# EAGLE design pcswtich (EAGLE 9.4.2)
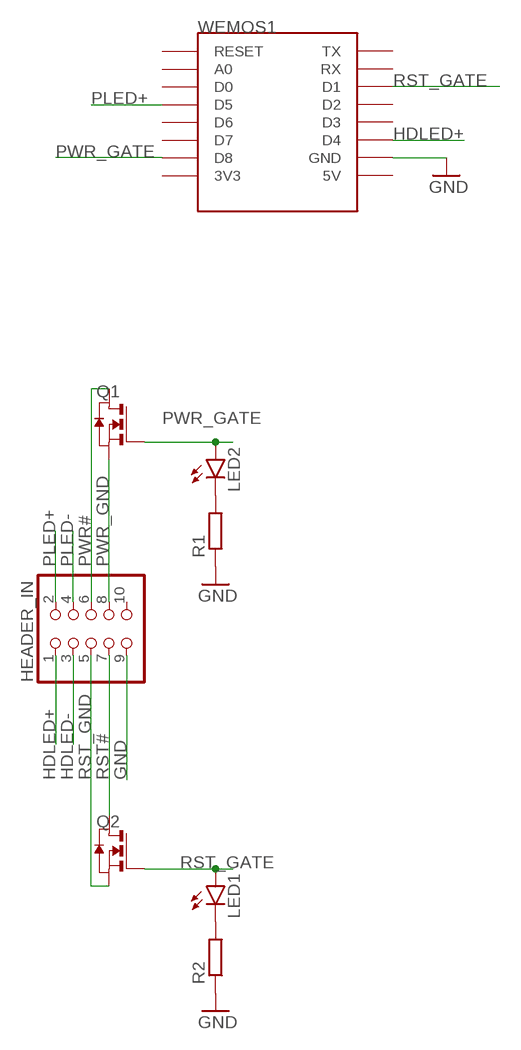
[diagram p0: schematic, sheet 1]

## Parts
HEADER_IN  PINHD-2X5  [2X05]
LED1  LEDCHIPLED_0805  [CHIPLED_0805]
LED2  LEDCHIPLED_0805  [CHIPLED_0805]
Q1  NMOSSOT23  [SOT-23]
Q2  NMOSSOT23  [SOT-23]
R1  R-EU_R0805  [R0805]
R2  R-EU_R0805  [R0805]
WEMOS1  WEMOS-D1-MINI  [WEMOS-D1-MINI]

## Nets
GND: HEADER_IN.9 R1.1 R2.1 WEMOS1.GND
HDLED+: HEADER_IN.1 WEMOS1.D4
HDLED-: HEADER_IN.3
N$1: LED2.C R1.2
N$2: LED1.C R2.2
PLED+: HEADER_IN.2 WEMOS1.D5
PLED-: HEADER_IN.4
PWR#: HEADER_IN.6 Q1.1(D)
PWR_GATE: LED2.A Q1.3(G) WEMOS1.D8
PWR_GND: HEADER_IN.8 Q1.2(S)
RST#: HEADER_IN.7 Q2.1(D)
RST_GATE: LED1.A Q2.3(G) WEMOS1.D1
RST_GND: HEADER_IN.5 Q2.2(S)
Unconnected: HEADER_IN.10 WEMOS1.3V3 WEMOS1.5V WEMOS1.A0 WEMOS1.D0 WEMOS1.D2 WEMOS1.D3 WEMOS1.D6 WEMOS1.D7 WEMOS1.RESET WEMOS1.RX WEMOS1.TX

## Library data of the parts
HEADER_IN = pinhead:PINHD-2X5: PIN HEADER
LED1 LED2 = led:LED: LED OSRAM: - CHIPLED LG R971, LG N971, LY N971, LG Q971, LY Q971, LO R971, LY R971 LH N974, LH R974 LS Q976, LO Q976, LY Q976 LO Q996 - Hyper CHIPLED LW Q18S LB Q993, LB Q99A, LB R99A - SideLED LS A670, LO A670, LY A670, LG A670, LP A670 LB A673, LV A673, LT A673, LW A673 LH A674 LY A675 LS A676, LA A676, LO A676, LY A676, LW A676 LS A679, LY A679, LG A679 - Hyper Micro SIDELED® LS Y876, LA Y876, LO Y876, LY Y876 LT Y87S - SmartLED LW L88C, LW L88S LB L89C, LB L89S, LG L890 LS L89K, LO L89K, LY L89K LS L896, LA L896, LO L896, LY L896 - TOPLED LS T670, LO T670, LY T670, LG T670, LP T670 LSG T670, LSP T670, LSY T670, LOP T670, LYG T670 LG T671, LOG T671, LSG T671 LB T673, LV T673, LT T673, LW T673 LH T674 LS T676, LA T676, LO T676, LY T676, LB T676, LH T676, LSB T676, LW T676 LB T67C, LV T67C, LT T67C, LS T67K, LO T67K, LY T67K, LW E67C LS E67B, LA E67B, LO E67B, LY E67B, LB E67C, LV E67C, LT E67C LW T67C LS T679, LY T679, LG T679 LS T770, LO T770, LY T770, LG T770, LP T770 LB T773, LV T773, LT T773, LW T773 LH T774 LS E675, LA E675, LY E675, LS T675 LS T776, LA T776, LO T776, LY T776, LB T776 LHGB T686 LT T68C, LB T68C - Hyper Mini TOPLED® LB M676 - Mini TOPLED Santana® LG M470 LS M47K, LO M47K, LY M47K Source: http://www.osram.convergy.de LUXEON: - LUMILED® LXK2-PW12-R00, LXK2-PW12-S00, LXK2-PW14-U00, LXK2-PW14-V00 LXK2-PM12-R00, LXK2-PM12-S00, LXK2-PM14-U00 LXK2-PE12-Q00, LXK2-PE12-R00, LXK2-PE12-S00, LXK2-PE14-T00, LXK2-PE14-U00 LXK2-PB12-K00, LXK2-PB12-L00, LXK2-PB12-M00, LXK2-PB14-N00, LXK2-PB14-P00, LXK2-PB14-Q00 LXK2-PR12-L00, LXK2-PR12-M00, LXK2-PR14-Q00, LXK2-PR14-R00 LXK2-PD12-Q00, LXK2-PD12-R00, LXK2-PD12-S00 LXK2-PH12-R00, LXK2-PH12-S00 LXK2-PL12-P00, LXK2-PL12-Q00, LXK2-PL12-R00 Source: www.luxeon.com KINGBRIGHT: KA-3528ASYC Source: www.kingbright.com
Q1 Q2 = zetex:NMOSSOT23: MOS FET; OC_FARNELL: unknown; OC_NEWARK: unknown
R1 R2 = rcl:R-EU_: RESISTOR, European symbol; SPICEPREFIX: R
WEMOS1 = esp8266modules:WEMOS-D1-MINI: WeMos.cc D1 mini ESP8266 module

## Board
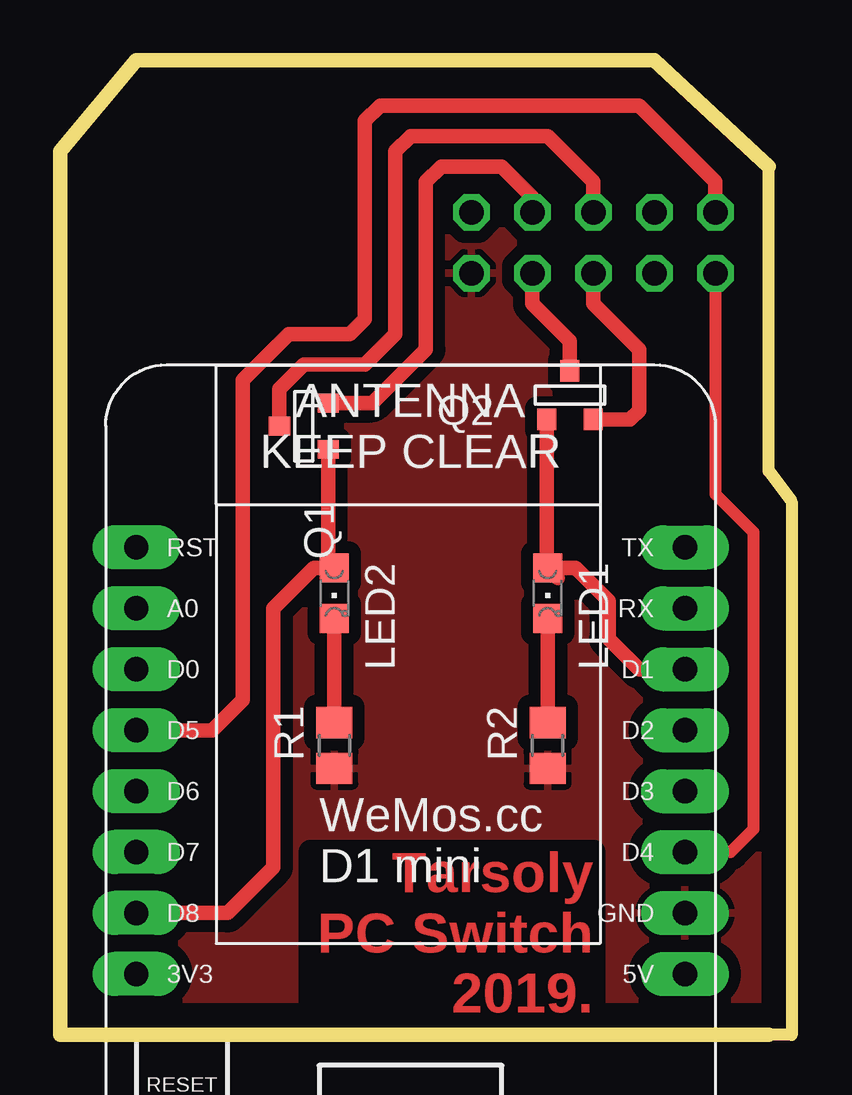
[diagram p1: board, top side]
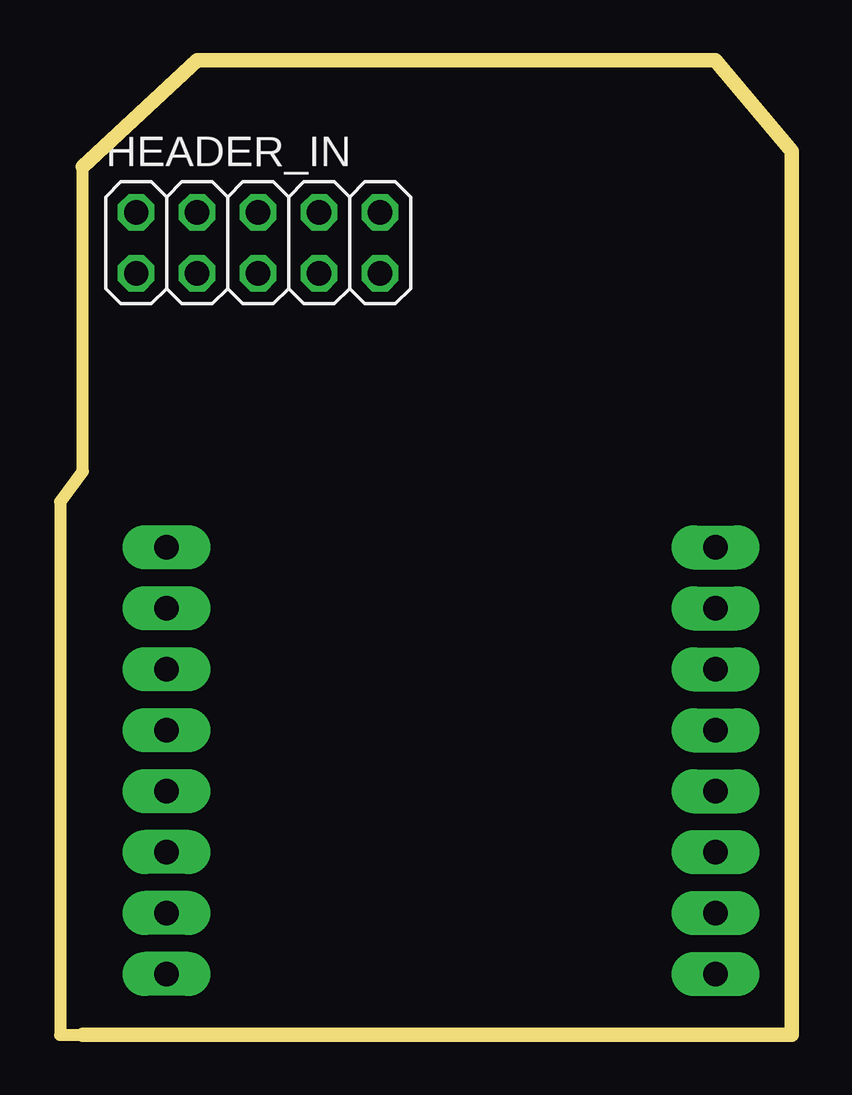
[diagram p2: board, bottom side, seen from below]

Size 30.48 x 40.64 mm. Coordinates in mm from the lower left corner, seen from the top.
Outline: 29.21,0 0,0 0,36.83 3.17,40.64 24.77,40.64 29.53,36.2 29.53,23.49 30.48,22.23 30.48,0 29.21,0
Outline: 29.21,0 29.53,0
Copper layers (1*16): Top 0.035mm / dielectric 1.5mm / Bottom 0.035mm
Design rules "default": minimum track width 6mil, minimum drill 0.35mm, track to track 6mil, track to pad 6mil, pad to pad 6mil, via to via 6mil, smd to smd 6mil, copper to edge 40mil, drill to drill 6mil, minimum pad ring 10mil, minimum via ring 8mil, stop-mask expansion 4mil, vias tented up to drill 0mil, thermal gap 10mil

### Footprints (pad centres in the part's own frame; a part is rotated, then mirrored left to right if it is on the bottom)
2X05 = drill 1.016 octagon: 1 -5.08,-1.27; 2 -5.08,1.27; 3 -2.54,-1.27; 4 -2.54,1.27; 5 0,-1.27; 6 0,1.27; 7 2.54,-1.27; 8 2.54,1.27; 9 5.08,-1.27; 10 5.08,1.27
CHIPLED_0805 = smd 1.2 x 1.2: A 0,-1.05; C 0,1.05
SOT-23 = smd 0.787 x 0.889: 1 0.025,-1.016; 2 -0.94,1.016; 3 0.991,1.016
R0805 = smd 1.3 x 1.5: 1 -0.95,0; 2 0.95,0
WEMOS-D1-MINI = drill 1.016 pad 1.829 long: 3V3 -10.16,-10.16; 5V 12.7,-10.16; A0 -10.16,5.08; D0 -10.16,2.54; D1 12.7,2.54; D2 12.7,0; D3 12.7,-2.54; D4 12.7,-5.08; D5 -10.16,0; D6 -10.16,-2.54; D7 -10.16,-5.08; D8 -10.16,-7.62; GND 12.7,-7.62; RESET -10.16,7.62; RX 12.7,5.08; TX 12.7,7.62

### Placement (x,y rotation side)
HEADER_IN  22.23,33.02 0 bottom
LED1  20.32,18.41 180 top
LED2  11.43,18.41 180 top
Q1  10.16,25.4 270 top
Q2  21.27,26.67 180 top
R1  11.43,12.06 90 top
R2  20.32,12.06 90 top
WEMOS1  13.34,12.7 0 top

### Tracks (layer width: path | path; a pad name or v marks a point on that pad's centre or on a via)
GND
  pour Top (isolate 0.508): 0.63,0.63 0.63,36.83 3.81,40 24.77,40 29.21,35.56 29.21,0.63
HDLED+
  Top 0.508: WEMOS1.D4 27.94,7.62 28.89,8.57 28.89,20.95 27.3,22.54 HEADER_IN.1
N$1
  Top 0.61: R1.2 LED2.C
N$2
  Top 0.61: LED1.C R2.2
PLED+
  Top 0.61: HEADER_IN.2 27.3,35.56 24.13,38.73 13.34,38.73 12.7,38.1 12.7,29.84 12.06,29.21 9.52,29.21 7.62,27.3 7.62,13.97 6.35,12.7 WEMOS1.D5
PWR#
  Top 0.61: HEADER_IN.6 22.23,35.56 20.32,37.47 14.6,37.47 13.97,36.83 13.97,29.21 12.7,27.94 10.16,27.94 9.14,26.92 Q1.1
PWR_GATE
  Top 0.61: Q1.3 11.18,19.72 LED2.A 10.57,19.46 8.89,17.78 8.89,6.98 6.98,5.08 WEMOS1.D8
PWR_GND
  Top 0.61: Q1.2 13,26.34 15.24,28.57 15.24,35.56 15.88,36.2 18.41,36.2 19.68,34.92 HEADER_IN.8
RST#
  Top 0.61: HEADER_IN.7 19.68,30.48 21.25,28.92 Q2.1
RST_GATE
  Top 0.61: LED1.A 20.73,19.05 | WEMOS1.D1 24.13,15.24 22.86,16.51 22.86,18.1 21.49,19.46 LED1.A | LED1.A 20.28,19.5 Q2.3
RST_GND
  Top 0.61: Q2.2 23.75,25.65 24.13,26.03 24.13,28.57 22.23,30.48 HEADER_IN.5

### Text on the board
Top: Tarsoly / PC Switch / 2019.